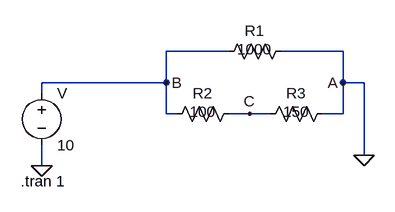
[diagram p0: schematic delta_network.asc]
delta_network.asc, the LTspice schematic file:
Version 4
SHEET 1 880 680
WIRE 224 48 128 48
WIRE 400 48 304 48
WIRE 128 96 128 48
WIRE 128 96 -64 96
WIRE 400 96 400 48
WIRE 432 96 400 96
WIRE -64 112 -64 96
WIRE 128 144 128 96
WIRE 144 144 128 144
WIRE 256 144 224 144
WIRE 288 144 256 144
WIRE 400 144 400 96
WIRE 400 144 368 144
WIRE 432 208 432 96
WIRE -64 224 -64 192
FLAG 256 144 C
FLAG 432 208 0
FLAG -64 224 0
FLAG 128 96 B
FLAG 400 96 A
SYMBOL voltage -64 96 R0
SYMATTR InstName V
SYMATTR Value 10
SYMBOL res 320 32 R90
WINDOW 0 0 56 VBottom 2
WINDOW 3 28 56 VBottom 2
SYMATTR InstName R1
SYMATTR Value 1000
SYMBOL res 240 128 R90
WINDOW 0 0 56 VBottom 2
WINDOW 3 28 56 VBottom 2
SYMATTR InstName R2
SYMATTR Value 100
SYMATTR SpiceLine tol=1 pwr=0.1
SYMBOL res 384 128 R90
WINDOW 0 0 56 VBottom 2
WINDOW 3 28 56 VBottom 2
SYMATTR InstName R3
SYMATTR Value 150
TEXT -96 248 Left 2 !.tran 1

The netlist it stands for:
* delta_network.asc
V B 0 10
R1 0 B 1000
R2 C B 100 tol=1 pwr=0.1
R3 0 C 150
.tran 1
.backanno
.end